# EAGLE design SparkFun_LED_Array_8x7 (EAGLE 7.2.0)
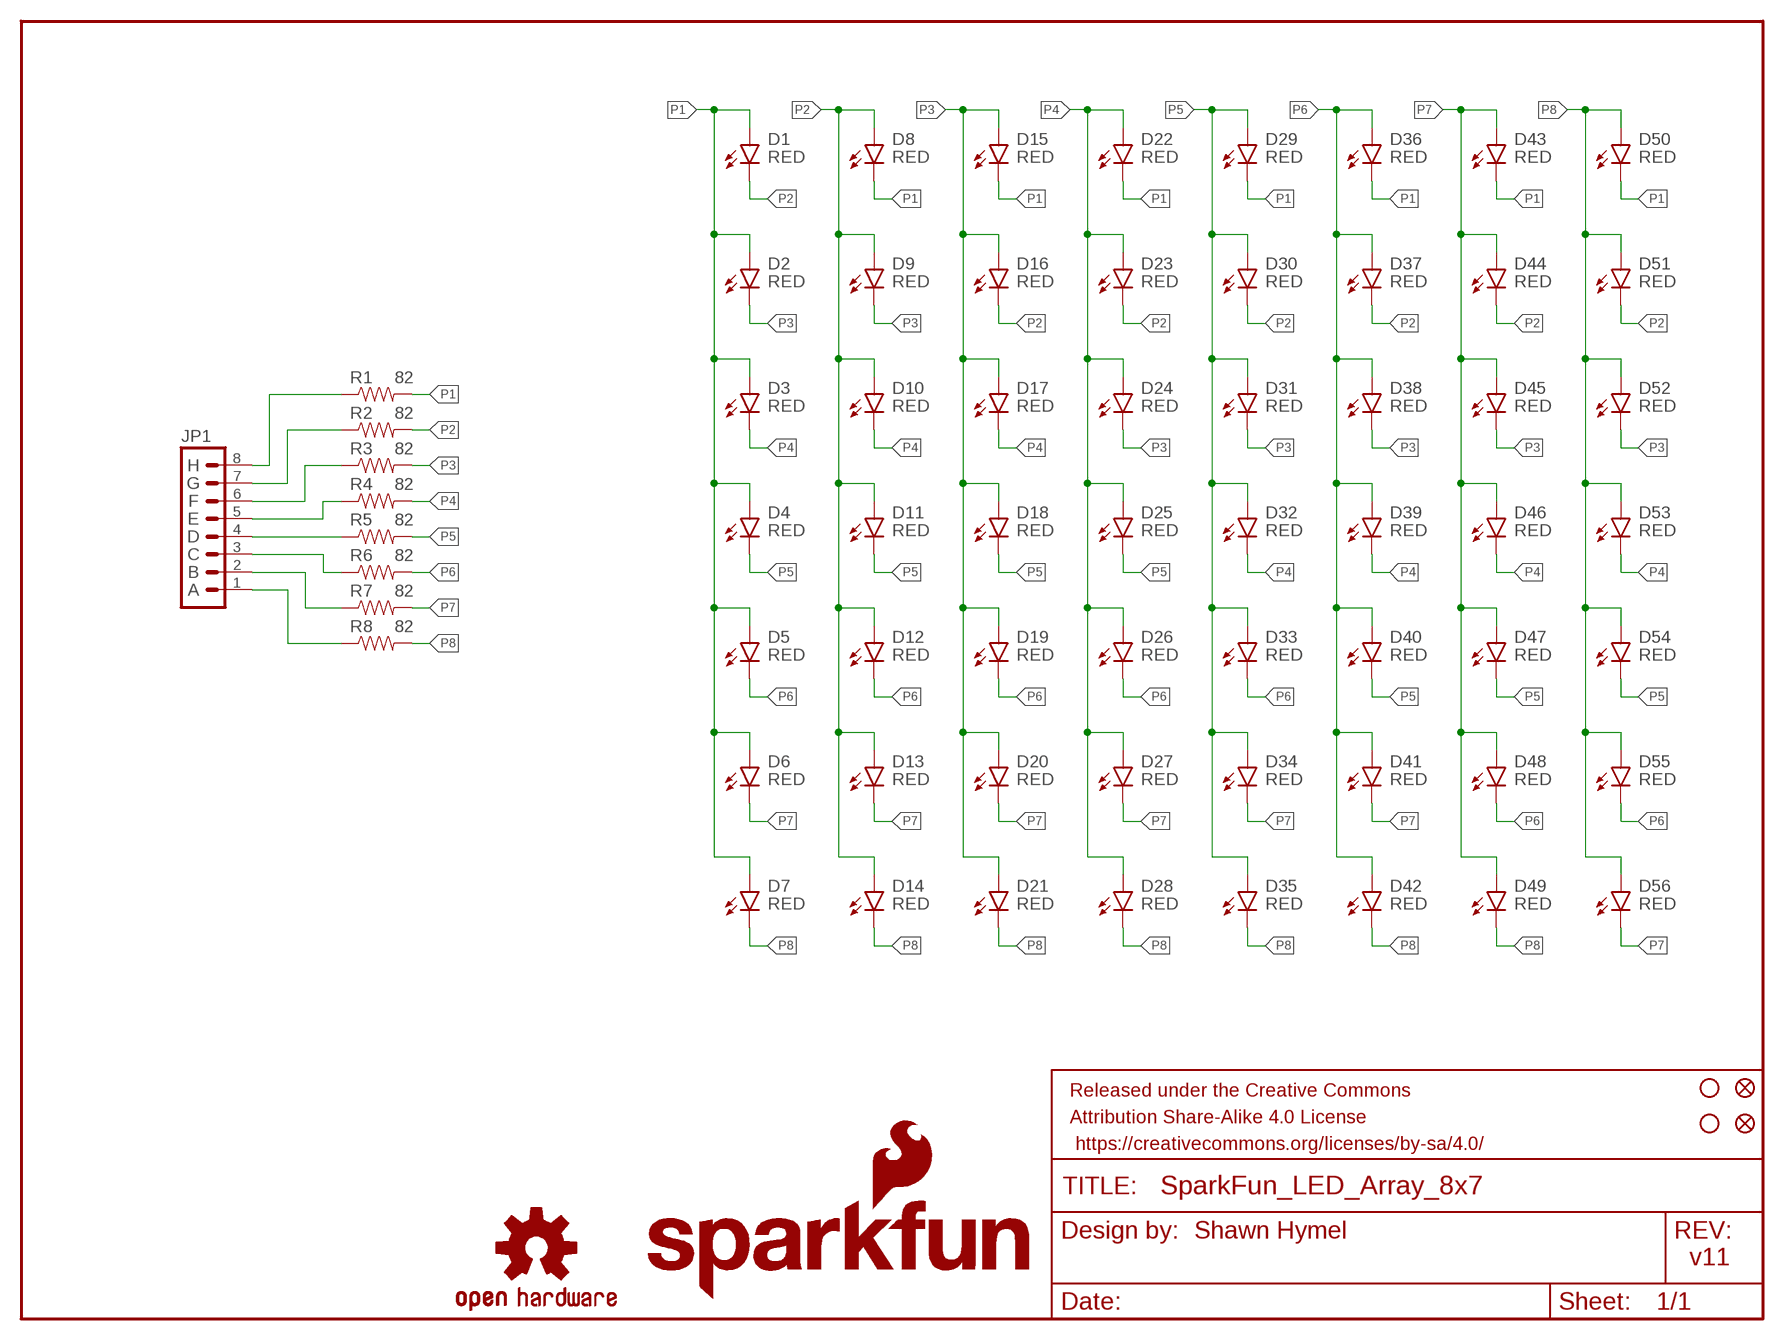
[diagram p0: schematic, sheet 1]

## Parts
D1  RED  LED-RED0603  [LED-0603]
D2  RED  LED-RED0603  [LED-0603]
D3  RED  LED-RED0603  [LED-0603]
D4  RED  LED-RED0603  [LED-0603]
D5  RED  LED-RED0603  [LED-0603]
D6  RED  LED-RED0603  [LED-0603]
D7  RED  LED-RED0603  [LED-0603]
D8  RED  LED-RED0603  [LED-0603]
D9  RED  LED-RED0603  [LED-0603]
D10  RED  LED-RED0603  [LED-0603]
D11  RED  LED-RED0603  [LED-0603]
D12  RED  LED-RED0603  [LED-0603]
D13  RED  LED-RED0603  [LED-0603]
D14  RED  LED-RED0603  [LED-0603]
D15  RED  LED-RED0603  [LED-0603]
D16  RED  LED-RED0603  [LED-0603]
D17  RED  LED-RED0603  [LED-0603]
D18  RED  LED-RED0603  [LED-0603]
D19  RED  LED-RED0603  [LED-0603]
D20  RED  LED-RED0603  [LED-0603]
D21  RED  LED-RED0603  [LED-0603]
D22  RED  LED-RED0603  [LED-0603]
D23  RED  LED-RED0603  [LED-0603]
D24  RED  LED-RED0603  [LED-0603]
D25  RED  LED-RED0603  [LED-0603]
D26  RED  LED-RED0603  [LED-0603]
D27  RED  LED-RED0603  [LED-0603]
D28  RED  LED-RED0603  [LED-0603]
D29  RED  LED-RED0603  [LED-0603]
D30  RED  LED-RED0603  [LED-0603]
D31  RED  LED-RED0603  [LED-0603]
D32  RED  LED-RED0603  [LED-0603]
D33  RED  LED-RED0603  [LED-0603]
D34  RED  LED-RED0603  [LED-0603]
D35  RED  LED-RED0603  [LED-0603]
D36  RED  LED-RED0603  [LED-0603]
D37  RED  LED-RED0603  [LED-0603]
D38  RED  LED-RED0603  [LED-0603]
D39  RED  LED-RED0603  [LED-0603]
D40  RED  LED-RED0603  [LED-0603]
D41  RED  LED-RED0603  [LED-0603]
D42  RED  LED-RED0603  [LED-0603]
D43  RED  LED-RED0603  [LED-0603]
D44  RED  LED-RED0603  [LED-0603]
D45  RED  LED-RED0603  [LED-0603]
D46  RED  LED-RED0603  [LED-0603]
D47  RED  LED-RED0603  [LED-0603]
D48  RED  LED-RED0603  [LED-0603]
D49  RED  LED-RED0603  [LED-0603]
D50  RED  LED-RED0603  [LED-0603]
D51  RED  LED-RED0603  [LED-0603]
D52  RED  LED-RED0603  [LED-0603]
D53  RED  LED-RED0603  [LED-0603]
D54  RED  LED-RED0603  [LED-0603]
D55  RED  LED-RED0603  [LED-0603]
D56  RED  LED-RED0603  [LED-0603]
FID1  FIDUCIAL1X2  [FIDUCIAL-1X2]
FID2  FIDUCIAL1X2  [FIDUCIAL-1X2]
FRAME1  FRAME-LETTER  [CREATIVE_COMMONS]
JP1  M08LOCK_NO_SILK  [1X08_LOCK_NO_SILK]
LOGO2  OSHW-LOGOS  [OSHW-LOGO-S]
R1  82  82OHM-1/10W-1%(0603)SMD  [0603-RES]
R2  82  82OHM-1/10W-1%(0603)SMD  [0603-RES]
R3  82  82OHM-1/10W-1%(0603)SMD  [0603-RES]
R4  82  82OHM-1/10W-1%(0603)SMD  [0603-RES]
R5  82  82OHM-1/10W-1%(0603)SMD  [0603-RES]
R6  82  82OHM-1/10W-1%(0603)SMD  [0603-RES]
R7  82  82OHM-1/10W-1%(0603)SMD  [0603-RES]
R8  82  82OHM-1/10W-1%(0603)SMD  [0603-RES]
STANDOFF1  STAND-OFF  [STAND-OFF]
STANDOFF2  STAND-OFF  [STAND-OFF]
U$1  SFE_LOGO_NAME_FLAME.1_INCH  [SFE_LOGO_NAME_FLAME_.1]

## Nets
N$1: JP1.4 R5.1
N$2: JP1.5 R4.1
N$3: JP1.6 R3.1
N$4: JP1.7 R2.1
N$5: JP1.8 R1.1
N$6: JP1.3 R6.1
N$7: JP1.2 R7.1
N$8: JP1.1 R8.1
P1: D1.A D2.A D3.A D4.A D5.A D6.A D7.A D8.C D15.C D22.C D29.C D36.C D43.C D50.C R1.2
P2: D1.C D8.A D9.A D10.A D11.A D12.A D13.A D14.A D16.C D23.C D30.C D37.C D44.C D51.C R2.2
P3: D2.C D9.C D15.A D16.A D17.A D18.A D19.A D20.A D21.A D24.C D31.C D38.C D45.C D52.C R3.2
P4: D3.C D10.C D17.C D22.A D23.A D24.A D25.A D26.A D27.A D28.A D32.C D39.C D46.C D53.C R4.2
P5: D4.C D11.C D18.C D25.C D29.A D30.A D31.A D32.A D33.A D34.A D35.A D40.C D47.C D54.C R5.2
P6: D5.C D12.C D19.C D26.C D33.C D36.A D37.A D38.A D39.A D40.A D41.A D42.A D48.C D55.C R6.2
P7: D6.C D13.C D20.C D27.C D34.C D41.C D43.A D44.A D45.A D46.A D47.A D48.A D49.A D56.C R7.2
P8: D7.C D14.C D21.C D28.C D35.C D42.C D49.C D50.A D51.A D52.A D53.A D54.A D55.A D56.A R8.2

## Notes on the sheet
- H
- G
- F
- E
- D
- C
- B
- A
- Shawn Hymel
- v11

## Library data of the parts
D1-D56 = SparkFun-LED:LED-RED: Assorted Red LEDs LilyPad 1206- DIO-09912 1206- DIO-00809 0603- DIO-00819 "SMART" means more efficient and expensive; PROD_ID: DIO-00819
FID1 FID2 = SparkFun-Aesthetics:FIDUCIAL: Fiducial Alignment Points Various fiducial points for machine vision alignment.
FRAME1 = SparkFun-Aesthetics:FRAME-LETTER: Schematic Frame Standard 8.5x11 US Letter frame
JP1 = SparkFun-Connectors:M08: Header 8 Standard 8-pin 0.1" header. Use with straight break away headers (SKU : PRT-00116), right angle break away headers (PRT-00553), swiss pins (PRT-00743), machine pins (PRT-00117), and female headers (PRT-00115).
LOGO2 = SparkFun-Aesthetics:OSHW-LOGO: Open Source Hardware Logo This logo indicates the piece of hardware it is found on incorporates a OSHW license and/or adheres to the definition of open source hardware found here: http://freedomdefined.org/OSHW
R1-R8 = SparkFun-Resistors:82OHM-1/10W-1%(0603): RES-12311; PROD_ID: RES-12311; VALUE: 820K
STANDOFF1 STANDOFF2 = SparkFun-Electromechanical:STAND-OFF: #4 Stand Off This is the mechanical footprint for a #4 phillips button head screw. Use the keepout ring to avoid running the screw head into surrounding components. SKU : PRT-00447
U$1 = SparkFun-Aesthetics:SFE_LOGO_NAME_FLAME: SFE Logo, name and flame This is the SparkFun full logo. The logo on the schematic will always be the same size; the package variant is the height of the flame part of the logo. Default layer for the logo on the board is tSilk.

## Board
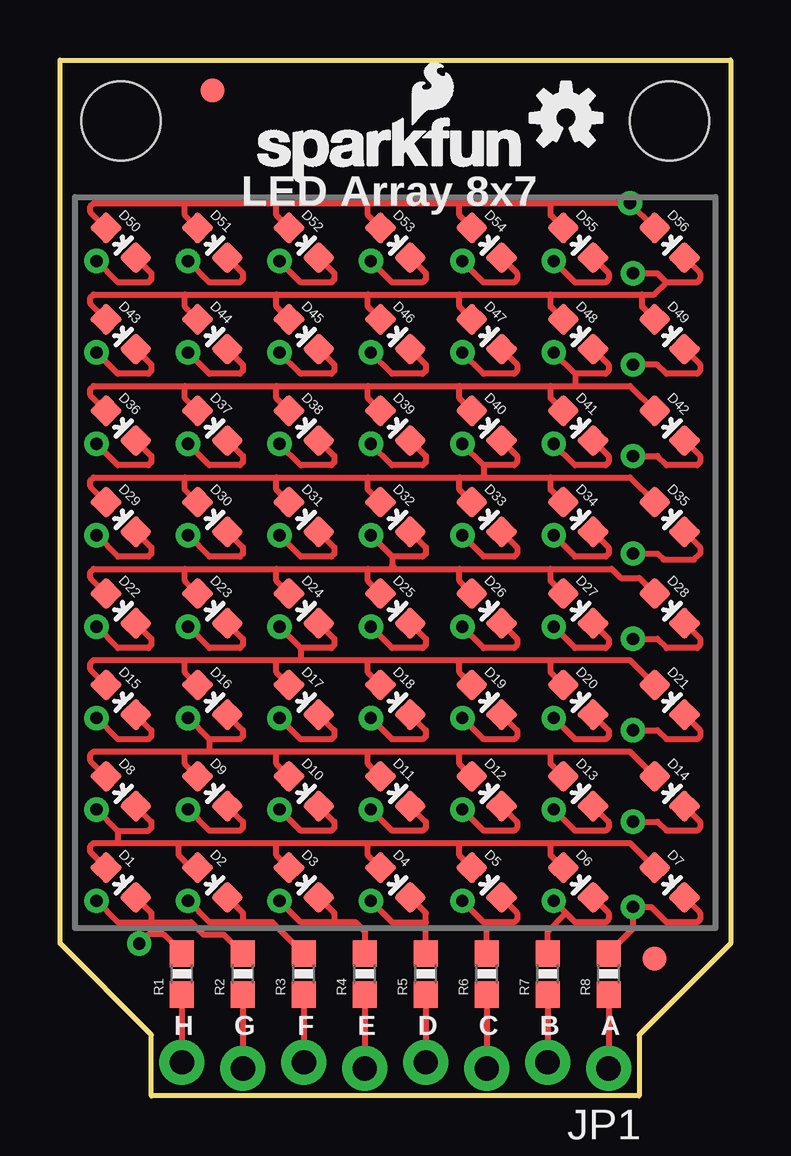
[diagram p1: board, top side]
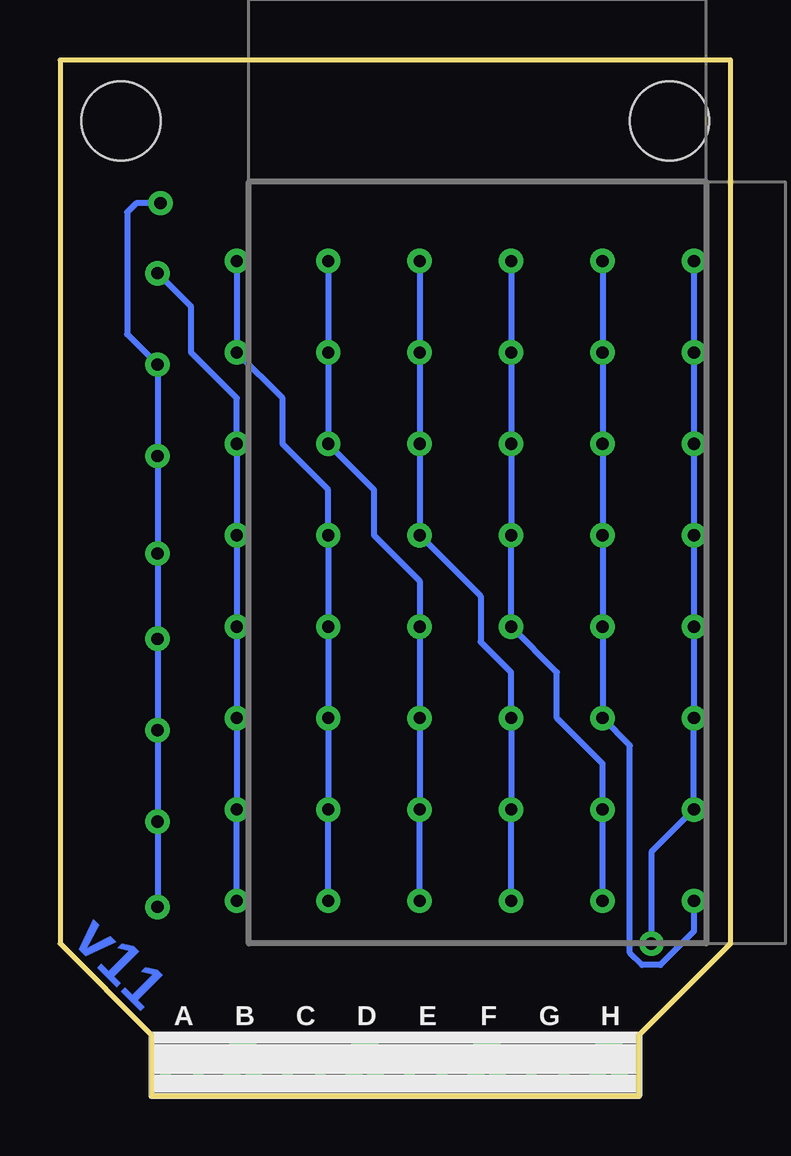
[diagram p2: board, bottom side, seen from below]

Size 27.94 x 43.18 mm. Coordinates in mm from the lower left corner, seen from the top.
Outline: 3.81,0 3.81,2.54 0,6.35 0,43.18 27.94,43.18 27.94,6.35 24.13,2.54 24.13,0 3.81,0
Copper layers (1*16): Top 0.035mm / dielectric 1.5mm / Bottom 0.035mm
Design rules "SparkFun-2-layer-STANDARD": minimum track width 10mil, minimum drill 20mil, track to track 10mil, track to pad 8mil, pad to pad 8mil, via to via 10mil, smd to smd 8mil, copper to edge 8mil, drill to drill 8mil, minimum pad ring 10mil, minimum via ring 10mil, stop-mask expansion 4mil, vias tented up to drill 20mil, thermal gap 10mil

### Footprints (pad centres in the part's own frame; a part is rotated, then mirrored left to right if it is on the bottom)
LED-0603 = smd 1 x 1: A 0,-0.877; C 0,0.877
FIDUCIAL-1X2 = smd 1 x 1: 1 0,0
1X08_LOCK_NO_SILK = drill 1.016 pad 1.88: 1 0,0.127; 2 2.54,-0.127; 3 5.08,0.127; 4 7.62,-0.127; 5 10.16,0.127; 6 12.7,-0.127; 7 15.24,0.127; 8 17.78,-0.127
0603-RES = smd 1.1 x 1: 1 -0.85,0; 2 0.85,0
STAND-OFF = hole 3.302: 0,0

### Placement (x,y rotation side)
D1  2.54,8.89 225 top
D2  6.35,8.89 225 top
D3  10.16,8.89 225 top
D4  13.97,8.89 225 top
D5  17.78,8.89 225 top
D6  21.59,8.89 225 top
D7  25.4,8.89 225 top
D8  2.54,12.7 225 top
D9  6.35,12.7 225 top
D10  10.16,12.7 225 top
D11  13.97,12.7 225 top
D12  17.78,12.7 225 top
D13  21.59,12.7 225 top
D14  25.4,12.7 225 top
D15  2.54,16.51 225 top
D16  6.35,16.51 225 top
D17  10.16,16.51 225 top
D18  13.97,16.51 225 top
D19  17.78,16.51 225 top
D20  21.59,16.51 225 top
D21  25.4,16.51 225 top
D22  2.54,20.32 225 top
D23  6.35,20.32 225 top
D24  10.16,20.32 225 top
D25  13.97,20.32 225 top
D26  17.78,20.32 225 top
D27  21.59,20.32 225 top
D28  25.4,20.32 225 top
D29  2.54,24.13 225 top
D30  6.35,24.13 225 top
D31  10.16,24.13 225 top
D32  13.97,24.13 225 top
D33  17.78,24.13 225 top
D34  21.59,24.13 225 top
D35  25.4,24.13 225 top
D36  2.54,27.94 225 top
D37  6.35,27.94 225 top
D38  10.16,27.94 225 top
D39  13.97,27.94 225 top
D40  17.78,27.94 225 top
D41  21.59,27.94 225 top
D42  25.4,27.94 225 top
D43  2.54,31.75 225 top
D44  6.35,31.75 225 top
D45  10.16,31.75 225 top
D46  13.97,31.75 225 top
D47  17.78,31.75 225 top
D48  21.59,31.75 225 top
D49  25.4,31.75 225 top
D50  2.54,35.56 225 top
D51  6.35,35.56 225 top
D52  10.16,35.56 225 top
D53  13.97,35.56 225 top
D54  17.78,35.56 225 top
D55  21.59,35.56 225 top
D56  25.4,35.56 225 top
FID1  24.77,5.71 0 top
FID2  6.35,41.91 0 top
FRAME1  -19.05,-21.59 0 top  (outside the outline)
JP1  22.86,1.27 180 top
LOGO2  21.08,40.77 0 top
R1  5.08,5.08 90 top
R2  7.62,5.08 90 top
R3  10.16,5.08 90 top
R4  12.7,5.08 90 top
R5  15.24,5.08 90 top
R6  17.78,5.08 90 top
R7  20.32,5.08 90 top
R8  22.86,5.08 90 top
STANDOFF1  25.4,40.64 90 top
STANDOFF2  2.54,40.64 90 top
U$1  7.82,37.85 0 top

### Tracks (layer width: path | path; a pad name or v marks a point on that pad's centre or on a via)
N$1
  Top 0.254: R5.1 JP1.4
N$2
  Top 0.254: R4.1 JP1.5
N$3
  Top 0.254: R3.1 JP1.6
N$4
  Top 0.254: R2.1 JP1.7
N$5
  Top 0.254: R1.1 JP1.8
N$6
  Top 0.254: R6.1 JP1.3
N$7
  Top 0.254: R7.1 JP1.2
N$8
  Top 0.254: R8.1 JP1.1
P1  (via drill 0.51)
  Top 0.254: D1.A | D1.A 1.27,10.16 1.27,10.41 1.4,10.54 2.41,10.54 | D8.C | D8.C 3.81,11.43 3.81,11.18 3.68,11.05 2.41,11.05 | 2.41,10.54 4.95,10.54 | 4.95,10.54 9.02,10.54 | 9.02,10.54 12.83,10.54 | 12.83,10.54 16.64,10.54 | 16.64,10.54 20.45,10.54 | 20.45,10.54 23.75,10.54 D7.A | D2.A 5.48,9.51 4.95,10.03 4.95,10.54 | D3.A | D3.A 9.02,10.03 9.02,10.54 | D4.A | D4.A 12.83,10.03 12.83,10.54 | D5.A | D5.A 16.64,10.03 16.64,10.54 | D6.A | D6.A 20.45,10.03 20.45,10.54 | D15.C | D15.C 3.81,15.24 3.81,14.99 3.68,14.86 2.41,14.86 v1.52,15.75 | 2.41,11.05 2.41,10.54 | v1.52,11.94 2.41,11.05 | D22.C | D22.C 3.81,19.05 3.81,18.8 3.68,18.67 2.41,18.67 v1.52,19.56 | D29.C | D29.C 3.81,22.86 3.81,22.61 3.68,22.48 2.41,22.48 v1.52,23.37 | D36.C | D36.C 3.81,26.67 3.81,26.42 3.68,26.29 2.41,26.29 v1.52,27.18 | D43.C | D43.C 3.81,30.48 3.81,30.23 3.68,30.1 2.41,30.1 v1.52,30.99 | D50.C | D50.C 3.81,34.29 3.81,34.04 3.68,33.91 2.41,33.91 v1.52,34.8 | R1.2 5.08,5.97 4.32,6.73 3.68,6.73 v3.3,6.35
  Bottom 0.254: v1.52,34.8 v1.52,30.99 v1.52,27.18 v1.52,23.37 v1.52,19.56 v1.52,15.75 v1.52,11.94 3.3,10.16 v3.3,6.35
P2  (via drill 0.51)
  Top 0.254: D8.A | D8.A 1.27,13.97 1.27,14.22 1.4,14.35 5.21,14.35 | 5.21,14.35 6.22,14.35 | 6.22,14.35 9.02,14.35 | 9.02,14.35 12.83,14.35 | 12.83,14.35 16.64,14.35 | 16.64,14.35 20.45,14.35 | 20.45,14.35 23.75,14.35 D14.A | D9.A | D9.A 5.21,13.84 5.21,14.35 | D10.A | D10.A 9.02,13.84 9.02,14.35 | D11.A | D11.A 12.83,13.84 12.83,14.35 | D12.A | D12.A 16.64,13.84 16.64,14.35 | D13.A | D13.A 20.45,13.84 20.45,14.35 | D16.C | D16.C 7.62,15.24 7.62,14.99 7.49,14.86 6.22,14.86 | 6.22,14.86 v5.33,15.75 | 6.22,14.86 6.22,14.35 | D23.C | D23.C 7.62,19.05 7.62,18.8 7.49,18.67 6.22,18.67 v5.33,19.56 | D30.C | D30.C 7.62,22.86 7.62,22.61 7.49,22.48 6.22,22.48 v5.33,23.37 | D37.C | D37.C 7.62,26.67 7.62,26.42 7.49,26.29 6.22,26.29 v5.33,27.18 | D44.C | D44.C 7.62,30.48 7.62,30.23 7.49,30.1 6.22,30.1 v5.33,30.99 | D51.C | D51.C 7.62,34.29 7.62,34.04 7.49,33.91 6.22,33.91 v5.33,34.8 | D1.C | D1.C 3.81,7.62 3.81,7.24 | 3.81,7.24 2.41,7.24 v1.52,8.13 | 3.81,7.24 5.46,7.24 5.97,6.73 6.82,6.73 R2.2
  Bottom 0.254: v5.33,34.8 v5.33,30.99 v5.33,27.18 v5.33,23.37 v5.33,19.56 v5.33,15.75 4.19,14.61 4.19,5.97 3.68,5.46 2.92,5.46 1.52,6.86 v1.52,8.13
P3  (via drill 0.51)
  Top 0.254: D9.C | D9.C 7.62,11.43 7.62,11.18 7.49,11.05 6.22,11.05 v5.33,11.94 | D15.A | D15.A 1.27,17.78 1.27,18.03 1.4,18.16 5.21,18.16 | 5.21,18.16 9.02,18.16 | 9.02,18.16 10.03,18.16 | 10.03,18.16 12.83,18.16 | 12.83,18.16 16.64,18.16 | 16.64,18.16 20.45,18.16 | 20.45,18.16 23.75,18.16 D21.A | D16.A | D16.A 5.21,17.65 5.21,18.16 | D17.A | D17.A 9.02,17.65 9.02,18.16 | D18.A | D18.A 12.83,17.65 12.83,18.16 | D19.A | D19.A 16.64,17.65 16.64,18.16 | D20.A | D20.A 20.45,17.65 20.45,18.16 | D24.C | D24.C 11.43,19.05 11.43,18.8 11.3,18.67 10.03,18.67 | 10.03,18.67 v9.14,19.56 | D31.C | D31.C 11.43,22.86 11.43,22.61 11.3,22.48 10.03,22.48 v9.14,23.37 | D38.C | D38.C 11.43,26.67 11.43,26.42 11.3,26.29 10.03,26.29 v9.14,27.18 | D45.C | D45.C 11.43,30.48 11.43,30.23 11.3,30.1 10.03,30.1 v9.14,30.99 | D52.C | D52.C 11.43,34.29 11.43,34.04 11.3,33.91 10.03,33.91 v9.14,34.8 | D2.C | 10.03,18.67 10.03,18.16 | R3.2 8.85,7.24 7.62,7.24 | D2.C 7.62,7.62 7.62,7.24 | 7.62,7.24 6.22,7.24 v5.33,8.13
  Bottom 0.254: v9.14,34.8 v9.14,30.99 v9.14,27.18 v9.14,23.37 v9.14,19.56 7.24,17.65 7.24,15.75 5.33,13.84 v5.33,11.94 v5.33,8.13
P4  (via drill 0.51)
  Top 0.254: D10.C | D10.C 11.43,11.43 11.43,11.18 11.3,11.05 10.03,11.05 v9.14,11.94 | D17.C | D17.C 11.43,15.24 11.43,14.99 11.3,14.86 10.03,14.86 v9.14,15.75 | D22.A | D22.A 1.27,21.59 1.27,21.84 1.4,21.97 5.21,21.97 | 5.21,21.97 9.02,21.97 | 9.02,21.97 12.83,21.97 | 12.83,21.97 13.97,21.97 | 13.97,21.97 16.64,21.97 | 16.64,21.97 20.45,21.97 | D23.A | D23.A 5.21,21.46 5.21,21.97 | D24.A | D24.A 9.02,21.46 9.02,21.97 | D25.A | D25.A 12.83,21.46 12.83,21.97 | D26.A | D26.A 16.64,21.46 16.64,21.97 | D27.A | D27.A 20.45,21.46 20.45,21.97 | D32.C | D32.C 15.24,22.86 15.24,22.61 15.11,22.48 13.84,22.48 | D39.C | D39.C 15.24,26.67 15.24,26.42 15.11,26.29 13.84,26.29 v12.95,27.18 | D46.C | D46.C 15.24,30.48 15.24,30.23 15.11,30.1 13.84,30.1 v12.95,30.99 | D53.C | D53.C 15.24,34.29 15.24,34.04 15.11,33.91 13.84,33.91 v12.95,34.8 | 13.84,22.48 v12.95,23.37 | D3.C | D3.C 11.43,7.62 11.43,7.24 | 11.43,7.24 12.32,7.24 12.7,6.86 R4.2 | 11.43,7.24 10.03,7.24 v9.14,8.13 | 13.84,22.48 13.84,22.1 13.97,21.97 | 20.45,21.97 22.99,21.97 23.37,21.59 24.13,21.59 D28.A
  Bottom 0.254: v12.95,34.8 v12.95,30.99 v12.95,27.18 v12.95,23.37 10.41,20.83 10.41,18.92 9.14,17.65 v9.14,15.75 v9.14,11.94 v9.14,8.13
P5  (via drill 0.51)
  Top 0.254: D11.C | D11.C 15.24,11.43 15.24,11.18 15.11,11.05 13.84,11.05 v12.95,11.94 | D18.C | D18.C 15.24,15.24 15.24,14.99 15.11,14.86 13.84,14.86 v12.95,15.75 | D29.A | D29.A 1.27,25.4 1.27,25.65 1.4,25.78 5.21,25.78 | 5.21,25.78 9.02,25.78 | 9.02,25.78 12.83,25.78 | 12.83,25.78 16.64,25.78 | 16.64,25.78 17.65,25.78 | 17.65,25.78 20.45,25.78 | 20.45,25.78 23.75,25.78 D35.A | D30.A | D30.A 5.21,25.27 5.21,25.78 | D31.A | D31.A 9.02,25.27 9.02,25.78 | D32.A | D32.A 12.83,25.27 12.83,25.78 | D33.A | D33.A 16.64,25.27 16.64,25.78 | D34.A | D34.A 20.45,25.27 20.45,25.78 | D25.C | D25.C 15.24,19.05 15.24,18.8 15.11,18.67 13.84,18.67 v12.95,19.56 | D40.C | D40.C 19.05,26.67 19.05,26.42 18.92,26.29 17.65,26.29 | D47.C | D47.C 19.05,30.48 19.05,30.23 18.92,30.1 17.65,30.1 v16.76,30.99 | D54.C | D54.C 19.05,34.29 19.05,34.04 18.92,33.91 17.65,33.91 v16.76,34.8 | 17.65,26.29 v16.76,27.18 | D4.C | D4.C 15.24,7.62 15.24,7.24 | v12.95,8.13 13.84,7.24 15.24,7.24 | 17.65,26.29 17.65,25.78 | R5.2 15.24,7.24
  Bottom 0.254: v12.95,8.13 v12.95,11.94 v12.95,15.75 v12.95,19.56 12.95,21.46 14.86,23.37 14.86,25.27 v16.76,27.18 v16.76,30.99 v16.76,34.8
P6  (via drill 0.51)
  Top 0.254: D12.C | D12.C 19.05,11.43 19.05,11.18 18.92,11.05 17.65,11.05 v16.76,11.94 | D19.C | D19.C 19.05,15.24 19.05,14.99 18.92,14.86 17.65,14.86 v16.76,15.75 | D36.A | D36.A 1.27,29.21 1.27,29.46 1.4,29.59 5.21,29.59 | 5.21,29.59 9.02,29.59 | 9.02,29.59 12.83,29.59 | 12.83,29.59 16.64,29.59 | 16.64,29.59 20.45,29.59 | 20.45,29.59 21.46,29.59 | 21.46,29.59 23.75,29.59 D42.A | D37.A | D37.A 5.21,29.08 5.21,29.59 | D38.A | D38.A 9.02,29.08 9.02,29.59 | D39.A | D39.A 12.83,29.08 12.83,29.59 | D40.A | D40.A 16.64,29.08 16.64,29.59 | D41.A | D41.A 20.45,29.08 20.45,29.59 | D26.C | D26.C 19.05,19.05 19.05,18.8 18.92,18.67 17.65,18.67 v16.76,19.56 | D33.C | D33.C 19.05,22.86 19.05,22.61 18.92,22.48 17.65,22.48 v16.76,23.37 | D48.C | D48.C 22.86,30.48 22.86,30.23 22.73,30.1 21.46,30.1 | D55.C | D55.C 22.86,34.29 22.86,34.04 22.73,33.91 21.46,33.91 v20.57,34.8 | 21.46,30.1 v20.57,30.99 | D5.C | D5.C 19.05,7.62 19.05,7.37 18.92,7.24 17.78,7.24 | 17.78,7.24 17.65,7.24 v16.76,8.13 | 21.46,30.1 21.46,29.59 | R6.2 17.78,7.24
  Bottom 0.254: v16.76,8.13 v16.76,11.94 v16.76,15.75 v16.76,19.56 v16.76,23.37 16.76,25.27 18.67,27.18 18.67,29.08 v20.57,30.99 v20.57,34.8
P7  (via drill 0.51)
  Top 0.254: D13.C | D13.C 22.86,11.43 22.86,11.18 22.73,11.05 21.46,11.05 v20.57,11.94 | D20.C | D20.C 22.86,15.24 22.86,14.99 22.73,14.86 21.46,14.86 v20.57,15.75 | D43.A | D43.A 1.27,33.02 1.27,33.27 1.4,33.4 5.21,33.4 | 5.21,33.4 9.02,33.4 | 9.02,33.4 12.83,33.4 | 12.83,33.4 16.64,33.4 | 16.64,33.4 20.45,33.4 | 20.45,33.4 24.26,33.4 | 24.26,33.4 24.77,33.4 25.27,33.91 | D44.A | D44.A 5.21,32.89 5.21,33.4 | D45.A | D45.A 9.02,32.89 9.02,33.4 | D46.A | D46.A 12.83,32.89 12.83,33.4 | D47.A | D47.A 16.64,32.89 16.64,33.4 | D48.A | D48.A 20.45,32.89 20.45,33.4 | D27.C | D27.C 22.86,19.05 22.86,18.8 22.73,18.67 21.46,18.67 v20.57,19.56 | D34.C | D34.C 22.86,22.86 22.86,22.61 22.73,22.48 21.46,22.48 v20.57,23.37 | D41.C | D41.C 22.86,26.67 22.86,26.42 22.73,26.29 21.46,26.29 v20.57,27.18 | D56.C | D56.C 26.67,34.29 26.67,34.04 26.54,33.91 25.27,33.91 | D6.C | D6.C 22.86,7.62 22.86,7.37 22.73,7.24 21.46,7.24 21.08,7.62 | 21.08,7.62 v20.57,8.13 | D49.A | D49.A 24.26,32.89 24.26,33.4 | R7.2 20.32,6.86 21.08,7.62 | 25.27,33.91 24.89,34.29 v23.88,34.29
  Bottom 0.254: v20.57,8.13 v20.57,11.94 v20.57,15.75 v20.57,19.56 v20.57,23.37 v20.57,27.18 20.57,29.08 22.48,30.99 22.48,32.89 v23.88,34.29
P8  (via drill 0.51)
  Top 0.254: D14.C | D14.C 26.67,11.43 26.67,11.18 26.54,11.05 25.27,11.05 24.89,11.43 v23.88,11.43 | D21.C | D21.C 26.67,15.24 26.67,14.99 26.54,14.86 25.27,14.86 24.89,15.24 v23.88,15.24 | D50.A | D50.A 1.27,36.83 1.27,37.08 1.4,37.21 5.21,37.21 | 5.21,37.21 9.02,37.21 | 9.02,37.21 12.83,37.21 | 12.83,37.21 16.64,37.21 | 16.64,37.21 20.45,37.21 | D51.A | D51.A 5.21,36.7 5.21,37.21 | D52.A | D52.A 9.02,36.7 9.02,37.21 | D53.A | D53.A 12.83,36.7 12.83,37.21 | D54.A | D54.A 16.64,36.7 16.64,37.21 | D55.A | D55.A 20.45,36.7 20.45,37.21 | D28.C | D28.C 26.67,19.05 26.67,18.8 26.54,18.67 25.27,18.67 24.89,19.05 v23.88,19.05 | D35.C | D35.C 26.67,22.86 26.67,22.61 26.42,22.35 25.15,22.35 24.89,22.61 v23.88,22.61 | D42.C | D42.C 26.67,26.67 26.67,26.42 26.54,26.29 25.27,26.29 24.89,26.67 v23.88,26.67 | D49.C | D49.C 26.67,30.48 26.67,30.23 26.54,30.1 25.27,30.1 24.89,30.48 v23.88,30.48 | D7.C | D7.C 26.67,7.62 26.67,7.37 26.54,7.24 25.27,7.24 24.64,7.87 v23.88,7.87 23.88,6.99 22.86,5.97 R8.2 | 20.45,37.21 v23.75,37.21 D56.A | D56.A
  Bottom 0.254: v23.88,7.87 v23.88,11.43 v23.88,15.24 v23.88,19.05 v23.88,22.61 v23.88,26.67 v23.88,30.48 25.15,31.75 25.15,36.83 24.77,37.21 v23.75,37.21

### Text on the board
Bottom: v11
tPlace: LED Array 8x7 | H | G | F | E | D | C | B | A
bPlace: H | G | F | E | D | C | B | A
Measures: 0.13
tDocu: Shawn Hymel